# Altium schematic sheet MISC.SchDoc
size A4; SheetNumber: 7; SheetTotal: 16
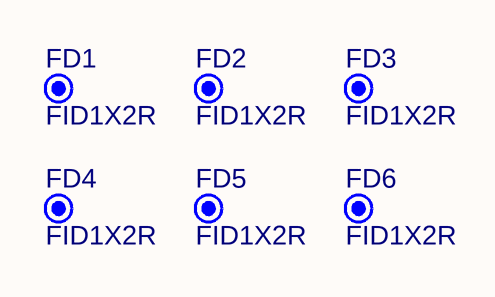
[diagram p0: MISC.SchDoc]

## Parts
FD1  FID1X2R  [FID1X2R]  (no BOM)
FD2  FID1X2R  [FID1X2R]  (no BOM)
FD3  FID1X2R  [FID1X2R]  (no BOM)
FD4  FID1X2R  [FID1X2R]  (no BOM)
FD5  FID1X2R  [FID1X2R]  (no BOM)
FD6  FID1X2R  [FID1X2R]  (no BOM)

## Library data of the parts
FD1-FD6 = CMP-00028-00005-4: Fiducial - Round 1x2mm; Pins: 0